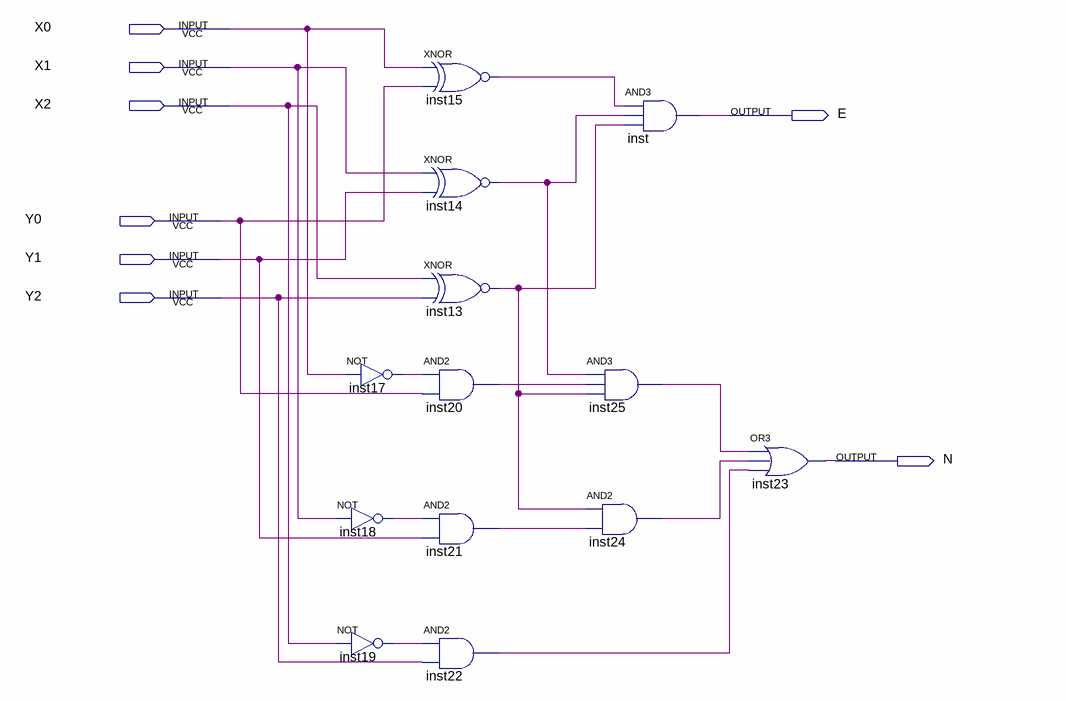
[diagram p0: schematic sheet]
// Quartus schematic Compare.bdf as structural Verilog: 13 symbols, 8 pins
module Compare (
  input  X0,
  input  X1,
  input  X2,
  input  Y0,
  input  Y1,
  input  Y2,
  output E,
  output N
);

  wire inst13_out, inst14_out, inst15_out, inst17_out, inst18_out, inst19_out, inst20_out, inst21_out,
       inst22_out, inst24_out, inst25_out;

  not inst17 (inst17_out, X0);
  not inst18 (inst18_out, X1);
  not inst19 (inst19_out, X2);
  xnor inst15 (inst15_out, X0, Y0);
  xnor inst14 (inst14_out, X1, Y1);
  xnor inst13 (inst13_out, X2, Y2);
  and inst20 (inst20_out, inst17_out, Y0);
  and inst21 (inst21_out, inst18_out, Y1);
  and inst22 (inst22_out, inst19_out, Y2);
  and inst (E, inst15_out, inst14_out, inst13_out);
  and inst25 (inst25_out, inst14_out, inst20_out, inst13_out);
  and inst24 (inst24_out, inst13_out, inst21_out);
  or inst23 (N, inst25_out, inst24_out, inst22_out);
endmodule
